# Altium schematic sheet filter.SchDoc
size A4
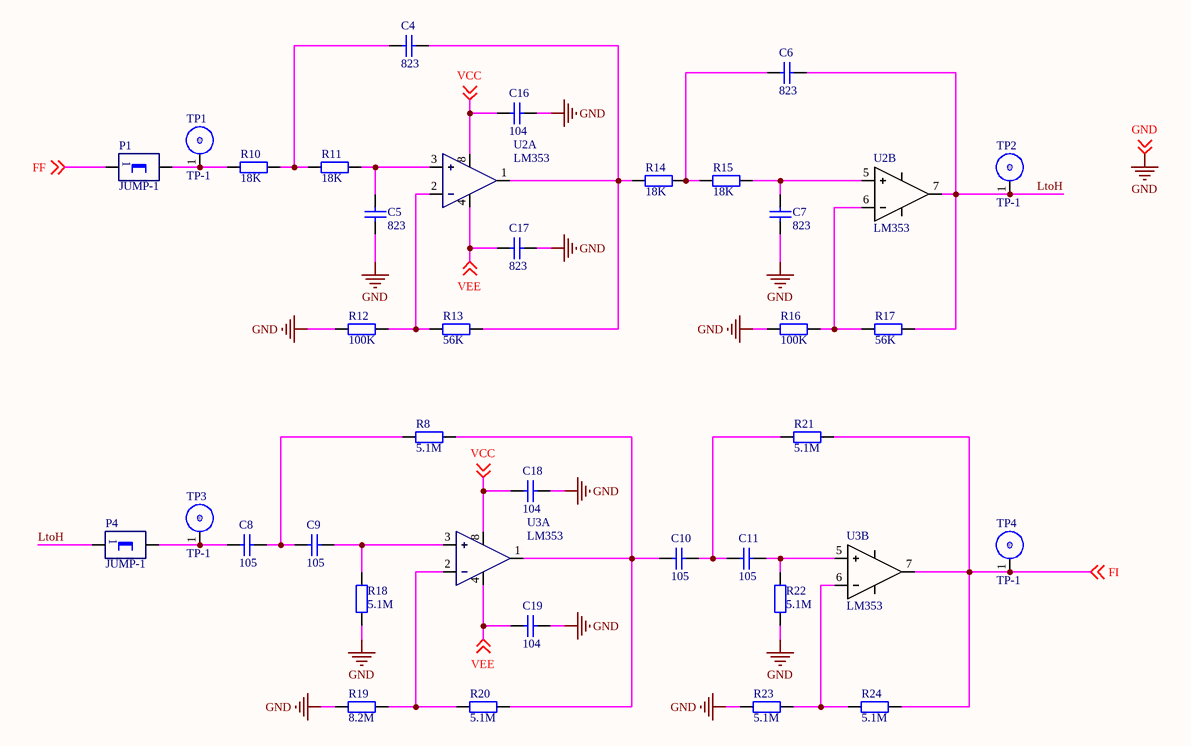
[diagram p0: filter.SchDoc]

## Parts
C4  823  [C2]
C5  823  [C2]
C6  823  [C2]
C7  823  [C2]
C8  105  [C2]
C9  105  [C2]
C10  105  [C2]
C11  105  [C2]
C16  104  [C2]
C17  823  [C2]
C18  104  [C2]
C19  104  [C2]
P1  JUMP-1  [SIP2]
P4  JUMP-1  [SIP2]
R8  5.1M  [AXIAL-0.3]
R10  18K  [AXIAL-0.3]
R11  18K  [AXIAL-0.3]
R12  100K  [AXIAL-0.3]
R13  56K  [AXIAL-0.3]
R14  18K  [AXIAL-0.3]
R15  18K  [AXIAL-0.3]
R16  100K  [AXIAL-0.3]
R17  56K  [AXIAL-0.3]
R18  5.1M  [AXIAL-0.3]
R19  8.2M  [AXIAL-0.3]
R20  5.1M  [AXIAL-0.3]
R21  5.1M  [AXIAL-0.3]
R22  5.1M  [AXIAL-0.3]
R23  5.1M  [AXIAL-0.3]
R24  5.1M  [AXIAL-0.3]
TP1  TP-1  [tp-1-1]
TP2  TP-1  [tp-1-1]
TP3  TP-1  [tp-1-1]
TP4  TP-1  [tp-1-1]
U2  LM353  [DIP8]  (parts A,B of 2)
U3  LM353  [DIP8]  (parts A,B of 2)

## Nets
GND: C5.1 C7.1 C16.2 C17.2 C18.2 C19.2 R12.1 R16.1 R18.1 R19.1 R22.1 R23.1 ; off-sheet GND
FF: P1.1 ; off-sheet FF
FI: R21.2 R24.2 TP4.1 U3.7 ; off-sheet FI
LtoH: C6.2 P4.1 R17.2 TP2.1 U2.7
VCC: C16.1 C18.1 U2.8 U3.8 ; off-sheet VCC
VEE: C17.1 C19.1 U2.4 U3.4 ; off-sheet VEE
NetC4_1: C4.1 R10.2 R11.1
NetC4_2: C4.2 R13.2 R14.1 U2.1
NetC5_2: C5.2 R11.2 U2.3
NetC6_1: C6.1 R14.2 R15.1
NetC7_2: C7.2 R15.2 U2.5
NetC8_1: C8.1 P4.2 TP3.1
NetC8_2: C8.2 C9.1 R8.1
NetC9_2: C9.2 R18.2 U3.3
NetC10_1: C10.1 R8.2 R20.2 U3.1
NetC10_2: C10.2 C11.1 R21.1
NetC11_2: C11.2 R22.2 U3.5
NetP1_2: P1.2 R10.1 TP1.1
NetR12_2: R12.2 R13.1 U2.2
NetR16_2: R16.2 R17.1 U2.6
NetR19_2: R19.2 R20.1 U3.2
NetR23_2: R23.2 R24.1 U3.6

## Library data of the parts
C4-C7 = Cap: Capacitor; Value: 82000pF; Published: 8-Jun-2000; LatestRevisionDate: 17-Jul-2002; LatestRevisionNote: Re-released for DXP Platform.; PackageReference: RAD-0.3; Publisher: Altium Limited; PackageDescription: Radial Cap, Thru-Hole; 2 Leads; 0.3 in Pin Spacing
C8-C11 = Cap: Capacitor; Value: 1000000pF; Published: 8-Jun-2000; LatestRevisionDate: 17-Jul-2002; LatestRevisionNote: Re-released for DXP Platform.; PackageReference: RAD-0.3; Publisher: Altium Limited; PackageDescription: Radial Cap, Thru-Hole; 2 Leads; 0.3 in Pin Spacing
C16 C18 C19 = Cap: Capacitor; Value: 100000pF; Published: 8-Jun-2000; LatestRevisionDate: 17-Jul-2002; LatestRevisionNote: Re-released for DXP Platform.; PackageReference: RAD-0.3; Publisher: Altium Limited; PackageDescription: Radial Cap, Thru-Hole; 2 Leads; 0.3 in Pin Spacing
C17 = Cap: Capacitor; Value: 10000pF; Published: 8-Jun-2000; LatestRevisionDate: 17-Jul-2002; LatestRevisionNote: Re-released for DXP Platform.; PackageReference: RAD-0.3; Publisher: Altium Limited; PackageDescription: Radial Cap, Thru-Hole; 2 Leads; 0.3 in Pin Spacing
R8 R18 R20-R24 = Res2: Resistor; Value: 5100K; Published: 8-Jun-2000; LatestRevisionDate: 17-Jul-2002; LatestRevisionNote: Re-released for DXP Platform.; PackageReference: AXIAL-0.4; Publisher: Altium Limited; PackageDescription: Axial Device, Thru-Hole; 2 Leads; 0.4 in Pin Spacing
R10-R17 = Res2: Resistor; Published: 8-Jun-2000; LatestRevisionDate: 17-Jul-2002; LatestRevisionNote: Re-released for DXP Platform.; PackageReference: AXIAL-0.4; Publisher: Altium Limited; PackageDescription: Axial Device, Thru-Hole; 2 Leads; 0.4 in Pin Spacing
  R10 R11 R14 R15: Value: 18K
  R12 R16: Value: 100K
  R13 R17: Value: 56K
R19 = Res2: Resistor; Value: 8200K; Published: 8-Jun-2000; LatestRevisionDate: 17-Jul-2002; LatestRevisionNote: Re-released for DXP Platform.; PackageReference: AXIAL-0.4; Publisher: Altium Limited; PackageDescription: Axial Device, Thru-Hole; 2 Leads; 0.4 in Pin Spacing